# EAGLE design logic (EAGLE 4.16)
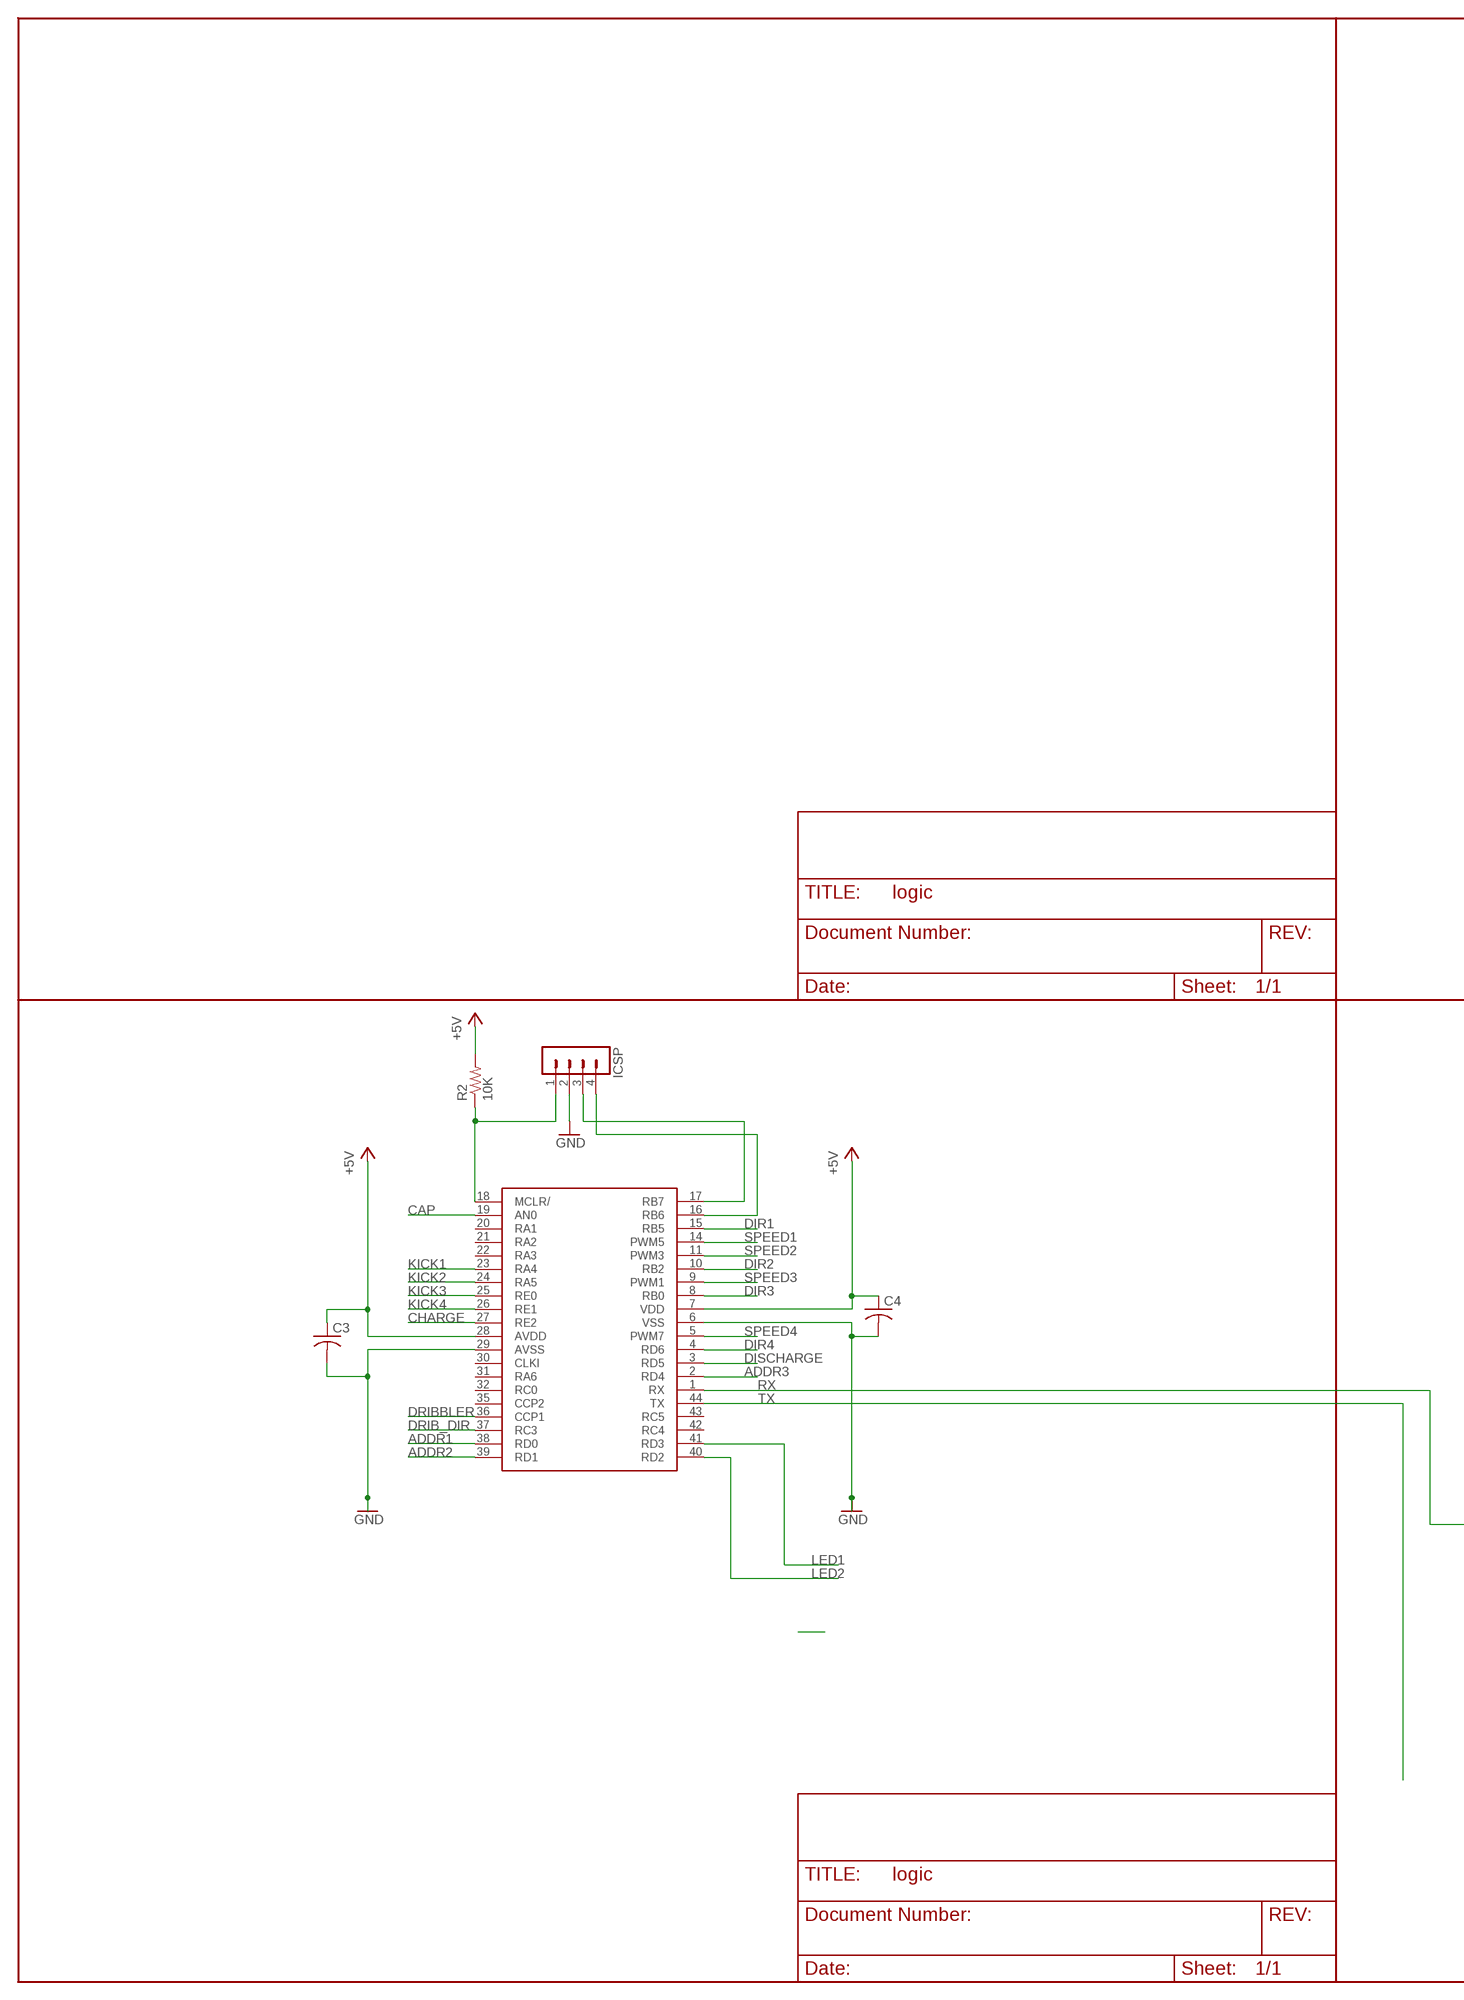
[diagram p0: schematic, sheet 1, part 1 of 2]
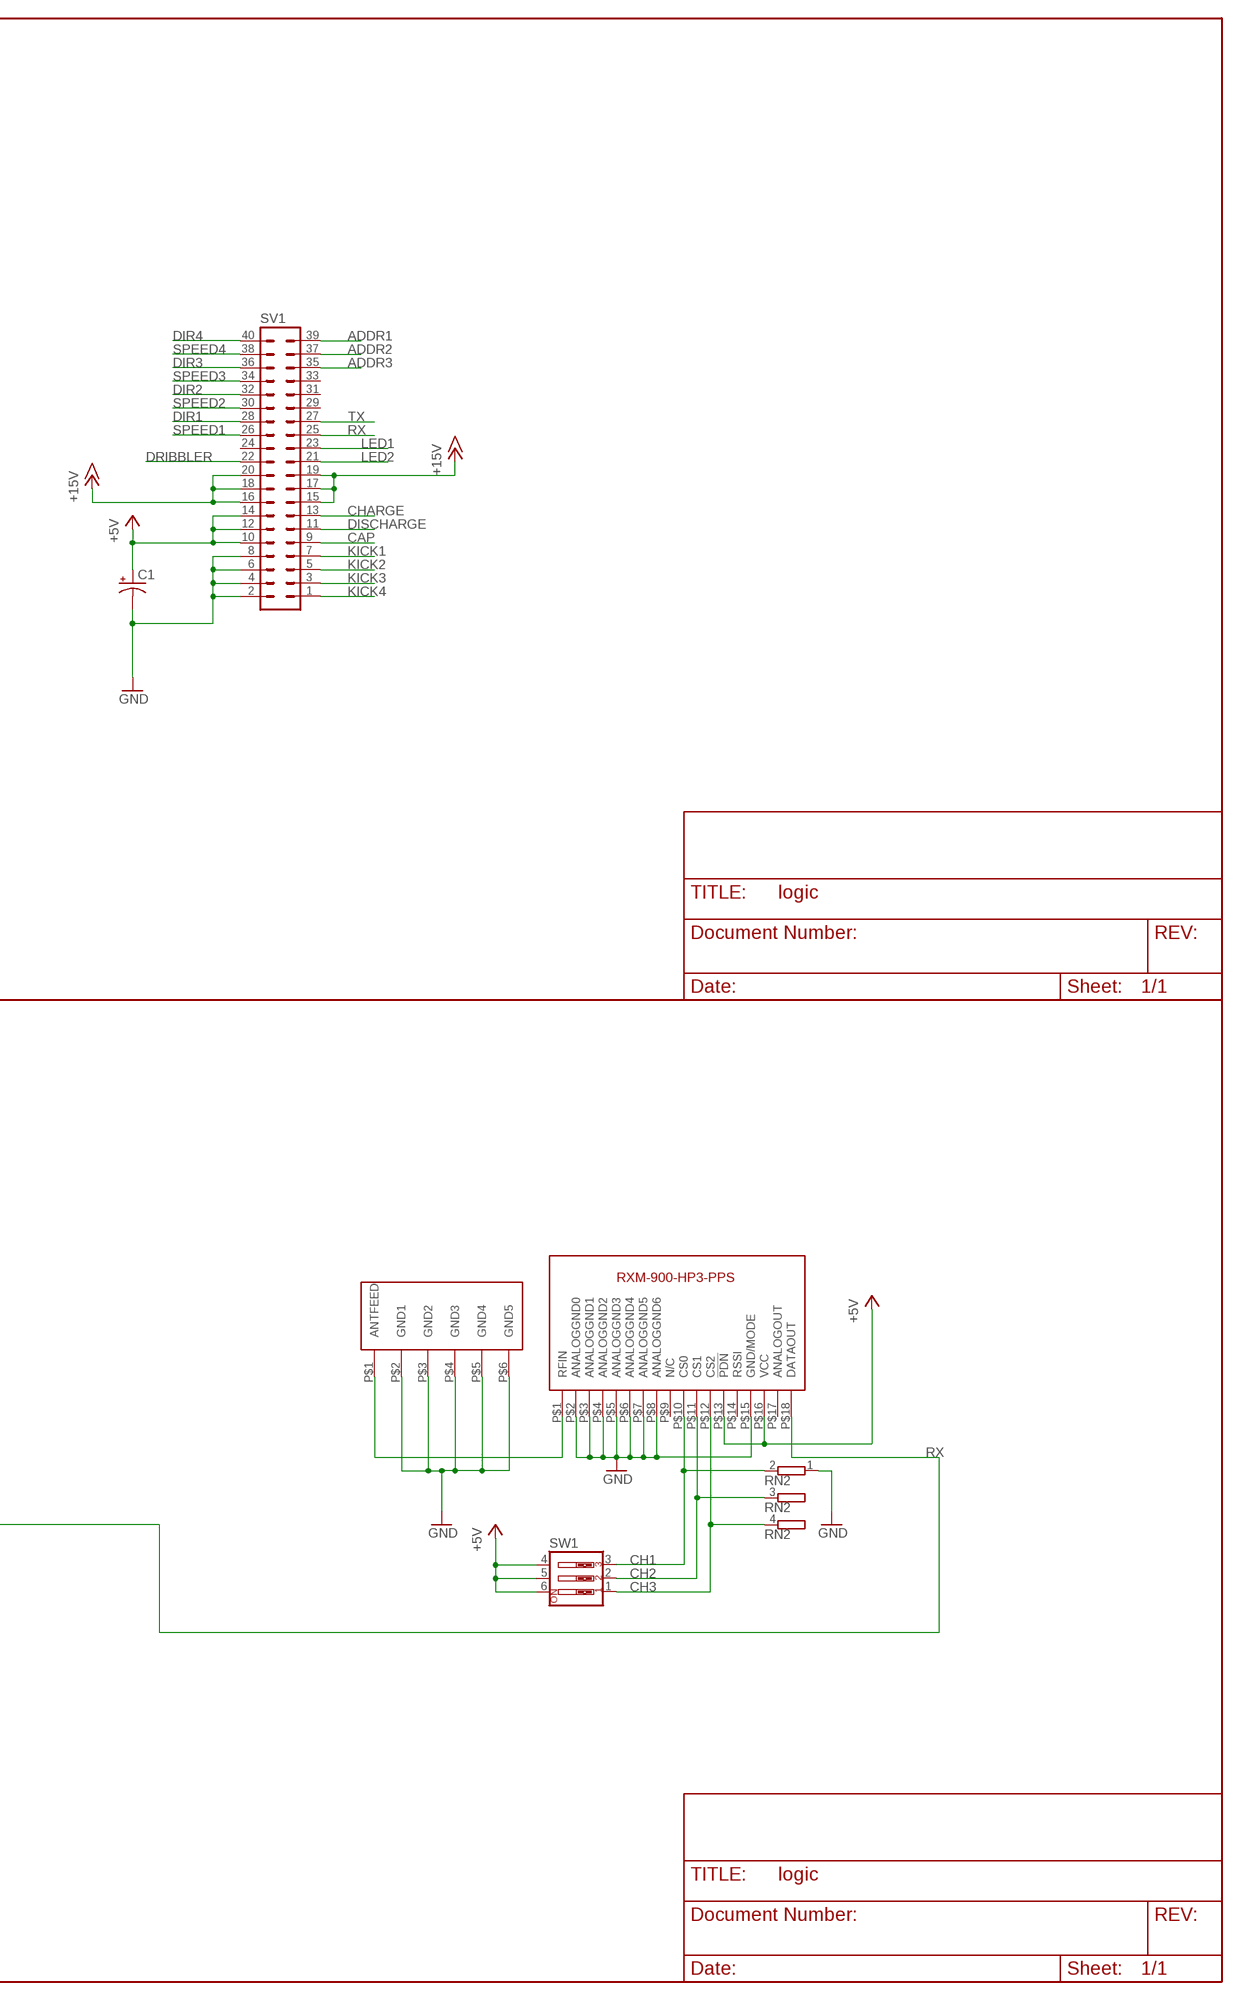
[diagram p1: schematic, sheet 1, part 2 of 2]

## Parts
C1  CPOL-USTT2D5  [TT2D5]
C3  C-USC0805  [C0805]
C4  C-USC0805  [C0805]
IC1  PIC18F4431  [TQFP44]
ICSP  MA04-1  [MA04-1]
R2  10K  R-US_R0805  [R0805]
RADIO  RXM-900-HP3-PPS  [SIP-18]
RN2  GE03RP  [SIL4]
SV1  MA20-2W  [MA20-2W]
SW1  SW_DIP-3  [EDG-03]
U$6  ANT-916-SP  [ANT-916-SP]

## Nets
+5V [supply]: C1.+ C3.1 C4.1 IC1.7(VDD) IC1.28(AVDD) R2.2 RADIO.P$13(!PDN) RADIO.P$16(VCC) SV1.10 SV1.12 SV1.14 SW1.4 SW1.5 SW1.6
+15V [supply]: SV1.15 SV1.16 SV1.17 SV1.18 SV1.19 SV1.20
ADDR1: IC1.38(RD0) SV1.39
ADDR2: IC1.39(RD1) SV1.37
ADDR3: IC1.2(RD4) SV1.35
CAP: IC1.19(AN0) SV1.9
CH1: RADIO.P$10(CS0) RN2.2 SW1.3
CH2: RADIO.P$11(CS1) RN2.3 SW1.2
CH3: RADIO.P$12(CS2) RN2.4 SW1.1
CHARGE: IC1.27(RE2) SV1.13
DIR1: IC1.15(RB5) SV1.28
DIR2: IC1.10(RB2) SV1.32
DIR3: IC1.8(RB0) SV1.36
DIR4: IC1.4(RD6) SV1.40
DISCHARGE: IC1.3(RD5) SV1.11
DRIB_DIR: IC1.37(RC3)
DRIBBLER: IC1.36(CCP1) SV1.22
GND [supply]: C1.- C3.2 C4.2 IC1.6(VSS) IC1.29(AVSS) ICSP.2 RADIO.P$2(ANALOGGND0) RADIO.P$3(ANALOGGND1) RADIO.P$4(ANALOGGND2) RADIO.P$5(ANALOGGND3) RADIO.P$6(ANALOGGND4) RADIO.P$7(ANALOGGND5) RADIO.P$8(ANALOGGND6) RADIO.P$15(GND/MODE) RN2.1 SV1.2 SV1.4 SV1.6 SV1.8 U$6.P$2(GND1) U$6.P$3(GND2) U$6.P$4(GND3) U$6.P$5(GND4) U$6.P$6(GND5)
KICK1: IC1.23(RA4) SV1.7
KICK2: IC1.24(RA5) SV1.5
KICK3: IC1.25(RE0) SV1.3
KICK4: IC1.26(RE1) SV1.1
LED1: IC1.41(RD3) SV1.23
LED2: IC1.40(RD2) SV1.21
N$6: IC1.18(MCLR/) ICSP.1 R2.1
N$7: IC1.17(RB7) ICSP.3
N$8: IC1.16(RB6) ICSP.4
N$45: RADIO.P$1(RFIN) U$6.P$1(ANTFEED)
RX: IC1.1(RX) RADIO.P$18(DATAOUT) SV1.25
SPEED1: IC1.14(PWM5) SV1.26
SPEED2: IC1.11(PWM3) SV1.30
SPEED3: IC1.9(PWM1) SV1.34
SPEED4: IC1.5(PWM7) SV1.38
TX: IC1.44(TX) SV1.27
Unconnected: IC1.20(RA1) IC1.21(RA2) IC1.22(RA3) IC1.30(CLKI) IC1.31(RA6) IC1.32(RC0) IC1.35(CCP2) IC1.42(RC4) IC1.43(RC5) RADIO.P$9(N/C) RADIO.P$14(RSSI) RADIO.P$17(ANALOGOUT) SV1.24 SV1.29 SV1.31 SV1.33

## Library data of the parts
C1 = rcl:CPOL-US: POLARIZED CAPACITOR, American symbol
C3 C4 = rcl:C-US: CAPACITOR, American symbol
IC1 = microchip:PIC18F4431
ICSP = con-lstb:MA04-1: PIN HEADER
R2 = rcl:R-US_: RESISTOR, American symbol
RADIO = linxtechnologies:RXM-900-HP3-PPS
RN2 = resistor-sil:GE03RP: SIL RESISTOR
SV1 = con-lstb:MA20-2W: PIN HEADER
SW1 = special:SW_DIP-3: DIP SWITCH
U$6 = smd-oscillator:ANT-916-SP

## Net classes
1 supply: width 0.508 mm

## Board
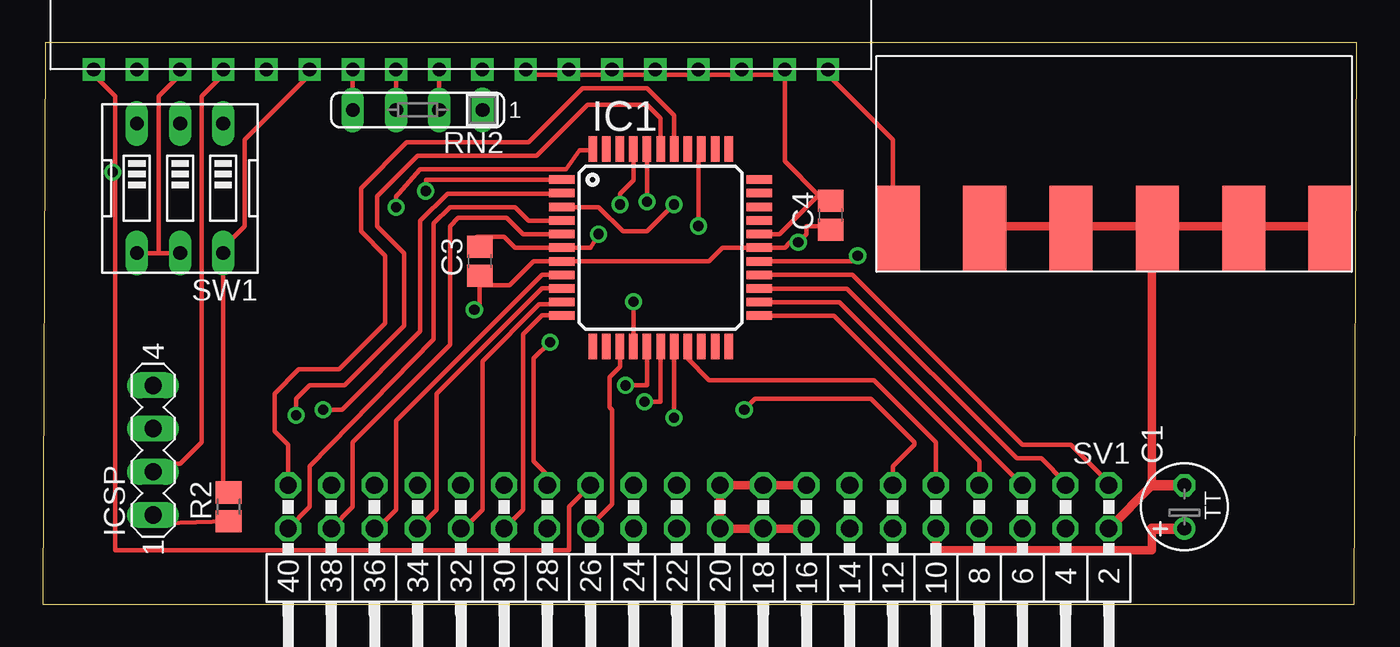
[diagram p2: board, top side]
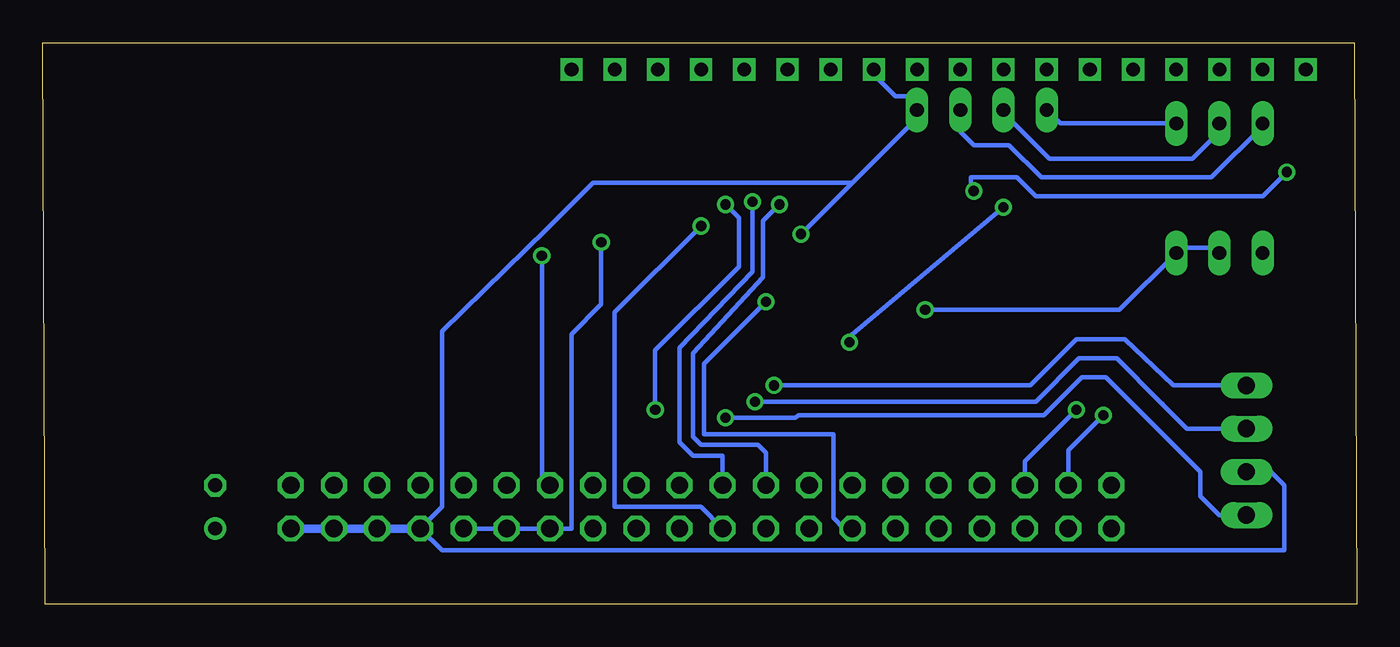
[diagram p3: board, bottom side, seen from below]

Size 77.3 x 33.01 mm. Coordinates in mm from the lower left corner, seen from the top.
Outline: 0,0 77.14,0 77.3,33.01 0.16,33.01 0,0
Copper layers (1*16): Top 0.035mm / dielectric 1.5mm / Bottom 0.035mm
Design rules "default": minimum track width 10mil, minimum drill 24mil, track to track 8mil, track to pad 8mil, pad to pad 8mil, via to via 8mil, smd to smd 8mil, copper to edge 40mil, drill to drill 8mil, minimum pad ring 10mil, minimum via ring 8mil, stop-mask expansion 4mil, vias tented up to drill 0mil, thermal gap 10mil

### Footprints (pad centres in the part's own frame; a part is rotated, then mirrored left to right if it is on the bottom)
TT2D5 = drill 0.813 round: + -1.27,0 | drill 0.813 octagon: - 1.27,0
C0805 = smd 1.3 x 1.5: 1 -0.85,0; 2 0.85,0
TQFP44 = smd 1.5 x 0.5: 1 -5.8,4; 2 -5.8,3.2; 3 -5.8,2.4; 4 -5.8,1.6; 5 -5.8,0.8; 6 -5.8,0; 7 -5.8,-0.8; 8 -5.8,-1.6; 9 -5.8,-2.4; 10 -5.8,-3.2; 11 -5.8,-4; 23 5.8,-4; 24 5.8,-3.2; 25 5.8,-2.4; 26 5.8,-1.6; 27 5.8,-0.8; 28 5.8,0; 29 5.8,0.8; 30 5.8,1.6; 31 5.8,2.4; 32 5.8,3.2; 33 5.8,4 | smd 0.5 x 1.5: 12 -4,-5.8; 13 -3.2,-5.8; 14 -2.4,-5.8; 15 -1.6,-5.8; 16 -0.8,-5.8; 17 0,-5.8; 18 0.8,-5.8; 19 1.6,-5.8; 20 2.4,-5.8; 21 3.2,-5.8; 22 4,-5.8; 34 4,5.8; 35 3.2,5.8; 36 2.4,5.8; 37 1.6,5.8; 38 0.8,5.8; 39 0,5.8; 40 -0.8,5.8; 41 -1.6,5.8; 42 -2.4,5.8; 43 -3.2,5.8; 44 -4,5.8
MA04-1 = drill 1.016 long: 1 -3.81,0; 2 -1.27,0; 3 1.27,0; 4 3.81,0
R0805 = smd 1.3 x 1.5: 1 -0.85,0; 2 0.85,0
SIP-18 = drill 0.8 square: P$1 0,0; P$2 2.54,0; P$3 5.08,0; P$4 7.62,0; P$5 10.16,0; P$6 12.7,0; P$7 15.24,0; P$8 17.78,0; P$9 20.32,0; P$10 22.86,0; P$11 25.4,0; P$12 27.94,0; P$13 30.48,0; P$14 33.02,0; P$15 35.56,0; P$16 38.1,0; P$17 40.64,0; P$18 43.18,0
SIL4 = drill 0.813 long: 1 -3.81,0; 2 -1.27,0; 3 1.27,0; 4 3.81,0
MA20-2W = drill 1.016 octagon: 1 -24.13,-1.27; 2 -24.13,1.27; 3 -21.59,-1.27; 4 -21.59,1.27; 5 -19.05,-1.27; 6 -19.05,1.27; 7 -16.51,-1.27; 8 -16.51,1.27; 9 -13.97,-1.27; 10 -13.97,1.27; 11 -11.43,-1.27; 12 -11.43,1.27; 13 -8.89,-1.27; 14 -8.89,1.27; 15 -6.35,-1.27; 16 -6.35,1.27; 17 -3.81,-1.27; 18 -3.81,1.27; 19 -1.27,-1.27; 20 -1.27,1.27; 21 1.27,-1.27; 22 1.27,1.27; 23 3.81,-1.27; 24 3.81,1.27; 25 6.35,-1.27; 26 6.35,1.27; 27 8.89,-1.27; 28 8.89,1.27; 29 11.43,-1.27; 30 11.43,1.27; 31 13.97,-1.27; 32 13.97,1.27; 33 16.51,-1.27; 34 16.51,1.27; 35 19.05,-1.27; 36 19.05,1.27; 37 21.59,-1.27; 38 21.59,1.27; 39 24.13,-1.27; 40 24.13,1.27
EDG-03 = drill 0.813 long: 1 -2.54,-3.81; 2 0,-3.81; 3 2.54,-3.81; 4 2.54,3.81; 5 0,3.81; 6 -2.54,3.81
ANT-916-SP = smd 2.54 x 5.08: P$1 -7.62,0; P$2 -2.54,0; P$3 2.54,0; P$4 7.62,0; P$5 12.7,0; P$6 17.78,0

### Placement (x,y rotation side)
C1  67.14,5.71 90 top
C3  25.71,20.16 90 top
C4  46.35,22.86 90 top
IC1  [TQFP44]  36.35,20.95 0 top
ICSP  6.5,9.04 90 top
R2  10.95,5.71 90 top
RADIO  46.19,31.43 180 top
RN2  22.06,29.05 180 top
SV1  38.57,5.71 180 top
SW1  8.09,24.44 180 top
U$6  57.94,22.06 0 top

### Tracks (layer width: path | path; a pad name or v marks a point on that pad's centre or on a via)
+5V  (via drill 0.6, 0.61)
  Top 0.254: 25.71,18.73 | 25.71,18.73 C3.1 25.71,17.62 v25.39,17.3 | 25.71,18.73 27.46,18.73 28.88,20.15 IC1.7 39.2,20.15 40,20.95 IC1.28 43.65,20.95 43.97,21.27 v44.44,21.27 44.92,21.74 44.92,22.22 46.19,22.22 C4.1 | 8.09,31.11 6.82,29.84 6.82,20.63 | 6.82,20.63 5.39,20.63 | 8.25,20.63 6.82,20.63 | R2.2 10.63,6.98 10.63,19.68 SW1.6 10.63,20.95 11.9,22.22 11.9,27.3 15.71,31.11 RADIO.P$13
  Top 0.508: 65.24,4.44 65.24,3.17 52.54,3.17 SV1.10 | 8.09,31.11 RADIO.P$16 | 5.39,20.63 SW1.4 | SW1.5 8.25,20.63
  Top 0.61: 65.24,4.44 C1.+
  Bottom 0.254: SV1.10 SV1.12 SV1.14 | SV1.14 47.3,4.44 | SW1.6 | SW1.6 10.79,20.47 | v44.44,21.27 44.44,17.62 46.19,15.87 46.19,4.44 SV1.14 | SW1.5 8.09,20.95 10.63,20.95 SW1.6 | SW1.6 13.96,17.3 v25.39,17.3 | SW1.6
+15V
  Top 0.508: SV1.16 SV1.18 SV1.20 SV1.19 SV1.17 SV1.15
ADDR1
  Top 0.254: SV1.39 14.44,9.36 13.65,10.16 13.65,12.38 15.08,13.81 17.46,13.81 20.15,16.5 20.15,20.47 18.73,21.9 18.73,24.44 21.42,27.14 28.57,27.14 31.74,30.32 35.55,30.32 37.14,28.73 37.14,26.82 37.15,26.82 IC1.38
ADDR2  (via drill 0.6)
  Top 0.254: v14.92,11.11 14.92,12.06 15.71,12.85 17.77,12.85 20.95,16.03 | 20.95,16.03 | 20.95,16.03 21.27,16.35 21.27,20.63 19.68,22.22 19.68,23.97 22.06,26.35 29.04,26.35 32.06,29.36 35.55,29.36 36.35,28.57 36.35,26.66 IC1.39
  Bottom 0.254: SV1.37 16.98,9.04 v14.92,11.11
ADDR3  (via drill 0.6)
  Top 0.254: v16.5,11.43 17.61,11.43 22.22,16.03 22.22,22.54 23.81,24.12 30.63,24.12 30.61,24.15 IC1.2
  Bottom 0.254: SV1.35 19.52,8.41 v16.5,11.43
CAP
  Top 0.254: SV1.9 52.54,9.52 48.89,13.17 39.2,13.17 37.94,14.44 37.94,15.24 37.95,15.22 IC1.19
CH1
  Top 0.254: RN2.2 RADIO.P$10
  Bottom 0.254: SW1.3 5.55,28.09 8.57,25.08 18.57,25.08 20.47,26.98 22.54,26.98 23.33,27.78 RN2.2
CH2
  Top 0.254: RN2.3 RADIO.P$11
  Bottom 0.254: SW1.2 8.09,27.78 9.68,26.19 18.09,26.19 20.79,28.89 RN2.3
CH3
  Top 0.254: 18.25,28.89 RN2.4 RADIO.P$12
  Bottom 0.254: SW1.1 17.46,28.25 RN2.4
CHARGE  (via drill 0.6)
  Top 0.254: IC1.27 47.61,20.15 v47.94,20.47
  Bottom 0.254: v47.94,20.47 47.94,7.46 SV1.13
DIR1  (via drill 0.6)
  Top 0.254: IC1.15 34.75,14.93 34.76,14.92 v34.76,17.77
  Bottom 0.254: SV1.28 30.16,4.44 30.79,5.08 30.79,10 38.41,10 38.41,14.12 v34.76,17.77
DIR2
  Top 0.254: SV1.32 24.76,4.44 25.87,5.55 25.87,14.28 29.2,17.62 30.79,17.62 30.66,17.75 IC1.10
DIR3
  Top 0.254: SV1.36 19.68,4.44 20.79,5.55 20.79,10.79 29.36,19.36 30.63,19.36 30.62,19.35 IC1.8
DIR4
  Top 0.254: SV1.40 15.71,5.71 15.71,8.09 23.01,15.55 23.01,22.38 23.96,23.33 27.77,23.33 28.57,22.54 30.47,22.54 30.49,22.55 IC1.4
DISCHARGE  (via drill 0.6)
  Top 0.254: SV1.11 50,8.09 51.27,9.36 51.27,9.52 48.73,12.06 41.9,12.06 v41.27,11.43 | v37.14,23.49 35.55,21.9 34.12,21.9 32.7,23.33 30.31,23.33 30.33,23.35 IC1.3
  Bottom 0.254: v41.27,11.43 41.27,14.92 36.35,19.84 36.35,22.7 v37.14,23.49
DRIBBLER  (via drill 0.61)
  Top 0.254: v38.57,22.22 38.57,26.03 IC1.36
  Bottom 0.254: v38.57,22.22 43.65,17.14 43.65,5.71 38.57,5.71 SV1.22
GND  (via drill 0.61)
  Top 0.254: C3.2 25.58,21.56 25.55,21.58 27.14,21.58 27.77,20.95 IC1.6 32.22,20.95 v32.7,21.74 | 10.63,31.11 9.36,29.84 9.36,9.52 8.09,8.25 6.82,8.25 ICSP.2 | 28.41,31.11 30.95,31.11 33.49,31.11 36.03,31.11 38.57,31.11 41.11,31.11 43.65,31.11 43.65,26.03 45.63,24.05 | 45.63,24.05 46.19,23.49 C4.2 | IC1.29 43.34,21.75 45.63,24.05 | 45.63,24.05 45.71,24.12
  Top 0.508: 10.63,31.11 RADIO.P$15 | RADIO.P$8 28.41,31.11 | 30.95,31.11 RADIO.P$7 | 33.49,31.11 RADIO.P$6 | 36.03,31.11 RADIO.P$5 | 38.57,31.11 RADIO.P$4 | 43.65,31.11 RADIO.P$2 | 41.11,31.11 RADIO.P$3 | U$6.P$6 75.4,22.22 71.59,22.22 U$6.P$5 70.32,22.22 66.51,22.22 U$6.P$4 | U$6.P$2 56.35,22.22 60.16,22.22 U$6.P$3 61.43,22.22 65.24,22.22 U$6.P$4 | SV1.2 65.24,6.98 65.24,7.14 65.24,19.68 U$6.P$4
  Top 0.61: C1.- 65.4,6.98 65.24,7.14
  Bottom 0.254: 28.41,31.11 27.14,29.84 25.87,29.84 RN2.1 25.87,28.57 29.68,24.76 | 29.68,24.76 v32.7,21.74 | 29.68,24.76 44.92,24.76 47.62,22.06 53.81,16.03 53.81,5.71 SV1.8 53.81,3.17 4.28,3.17 4.28,6.98 5.55,8.25 ICSP.2
  Bottom 0.508: SV1.8 SV1.6 SV1.4 SV1.2 | 28.41,31.11 RADIO.P$8
KICK1
  Top 0.254: IC1.23 46.54,16.95 55.08,8.41 SV1.7
KICK2
  Top 0.254: IC1.24 46.85,17.75 SV1.5
KICK3
  Top 0.254: IC1.25 47.32,18.55 57.3,8.57 58.73,8.57 60.16,7.14 SV1.3
KICK4
  Top 0.254: IC1.26 47.63,19.35 57.62,9.36 60.48,9.36 62.7,7.14 SV1.1
LED1  (via drill 0.6)
  Top 0.254: v33.97,23.49 33.97,24.12 34.76,24.92 34.76,26.98 34.75,26.97 IC1.41
  Bottom 0.254: SV1.23 34.76,8.89 35.24,9.36 38.57,9.36 39.05,9.84 39.05,14.76 34.92,19.2 34.92,22.54 v33.97,23.49
LED2  (via drill 0.6)
  Top 0.254: v35.55,23.65 35.55,24.76 35.55,26.66 35.55,26.67 IC1.40
  Bottom 0.254: SV1.21 37.3,8.73 39.05,8.73 39.84,9.52 39.84,15.08 35.55,19.52 v35.55,23.65
N$6  (via drill 0.6)
  Top 0.254: IC1.18 37.15,11.91 v37.14,10.95 | ICSP.1 6.66,5.23 7.13,4.76 R2.1
  Bottom 0.254: v37.14,10.95 33.01,10.95 32.85,11.11 18.41,11.11 16.19,13.33 14.76,13.33 11.74,10.31 | 11.74,10.31 | 11.74,10.31 9.2,7.77 9.2,6.34 8.09,5.23 ICSP.1 6.34,5.23
N$7  (via drill 0.6)
  Top 0.254: IC1.17 36.35,12.06 36.35,11.9 v35.39,11.9
  Bottom 0.254: v35.39,11.9 18.88,11.9 16.34,14.44 14.12,14.44 11.58,11.9 | 11.58,11.9 11.42,11.74 | ICSP.3 10,10.31 11.58,11.9
N$8  (via drill 0.6)
  Top 0.254: IC1.16 35.55,15.23 35.55,15.24 35.55,12.85 v34.28,12.85
  Bottom 0.254: v34.28,12.85 19.2,12.85 16.5,15.55 13.65,15.55 10.79,12.85 ICSP.4
N$45
  Top 0.254: RADIO.P$1 46.19,31.11 50,27.3 50,23.49 U$6.P$1
RX  (via drill 0.6)
  Top 0.254: 4.28,26.03 4.28,3.17 30.95,3.17 30.95,5.71 SV1.25 | 4.28,26.03 4.28,29.84 3.01,31.11 RADIO.P$18 | IC1.1 22.57,24.95 v22.54,24.28 | v4.12,25.39 4.12,25.87 4.28,26.03
  Bottom 0.254: v22.54,24.28 22.7,24.28 22.7,25.08 20,25.08 18.88,23.97 5.55,23.97 v4.12,25.39
SPEED1
  Top 0.254: SV1.26 32.22,4.6 33.49,5.87 33.49,11.43 33.33,11.58 33.33,13.33 33.97,13.97 33.97,15.08 33.95,15.1 IC1.14
SPEED2
  Top 0.254: SV1.30 28.25,5.55 28.25,15.87 29.36,16.98 30.95,16.98 30.92,16.95 IC1.11
SPEED3
  Top 0.254: SV1.34 23.17,5.55 23.17,12.38 29.36,18.57 30.63,18.57 30.61,18.55 IC1.9
SPEED4
  Top 0.254: IC1.5 28.24,21.75 27.3,22.7 24.44,22.7 23.96,22.22 23.96,15.24 18.25,9.52 18.25,5.71 SV1.38
TX  (via drill 0.6)
  Top 0.254: SV1.27 29.68,7.62 28.89,8.41 28.89,14.44 v29.84,15.39 | v20.79,23.33 20.79,23.97 20.95,24.12 22.22,25.55 30.79,25.55 31.58,26.66 32.38,26.66 32.38,26.82 32.35,26.79 IC1.44
  Bottom 0.254: v29.84,15.39 29.84,15.71 v20.79,23.33